# EasyEDA schematic SCH_Avionic1_2026-04-20.json
TITLE: Sheet_1; REV: 1.0; Date: 2026-02-07; Sheet: 1/1; Company: Your Company
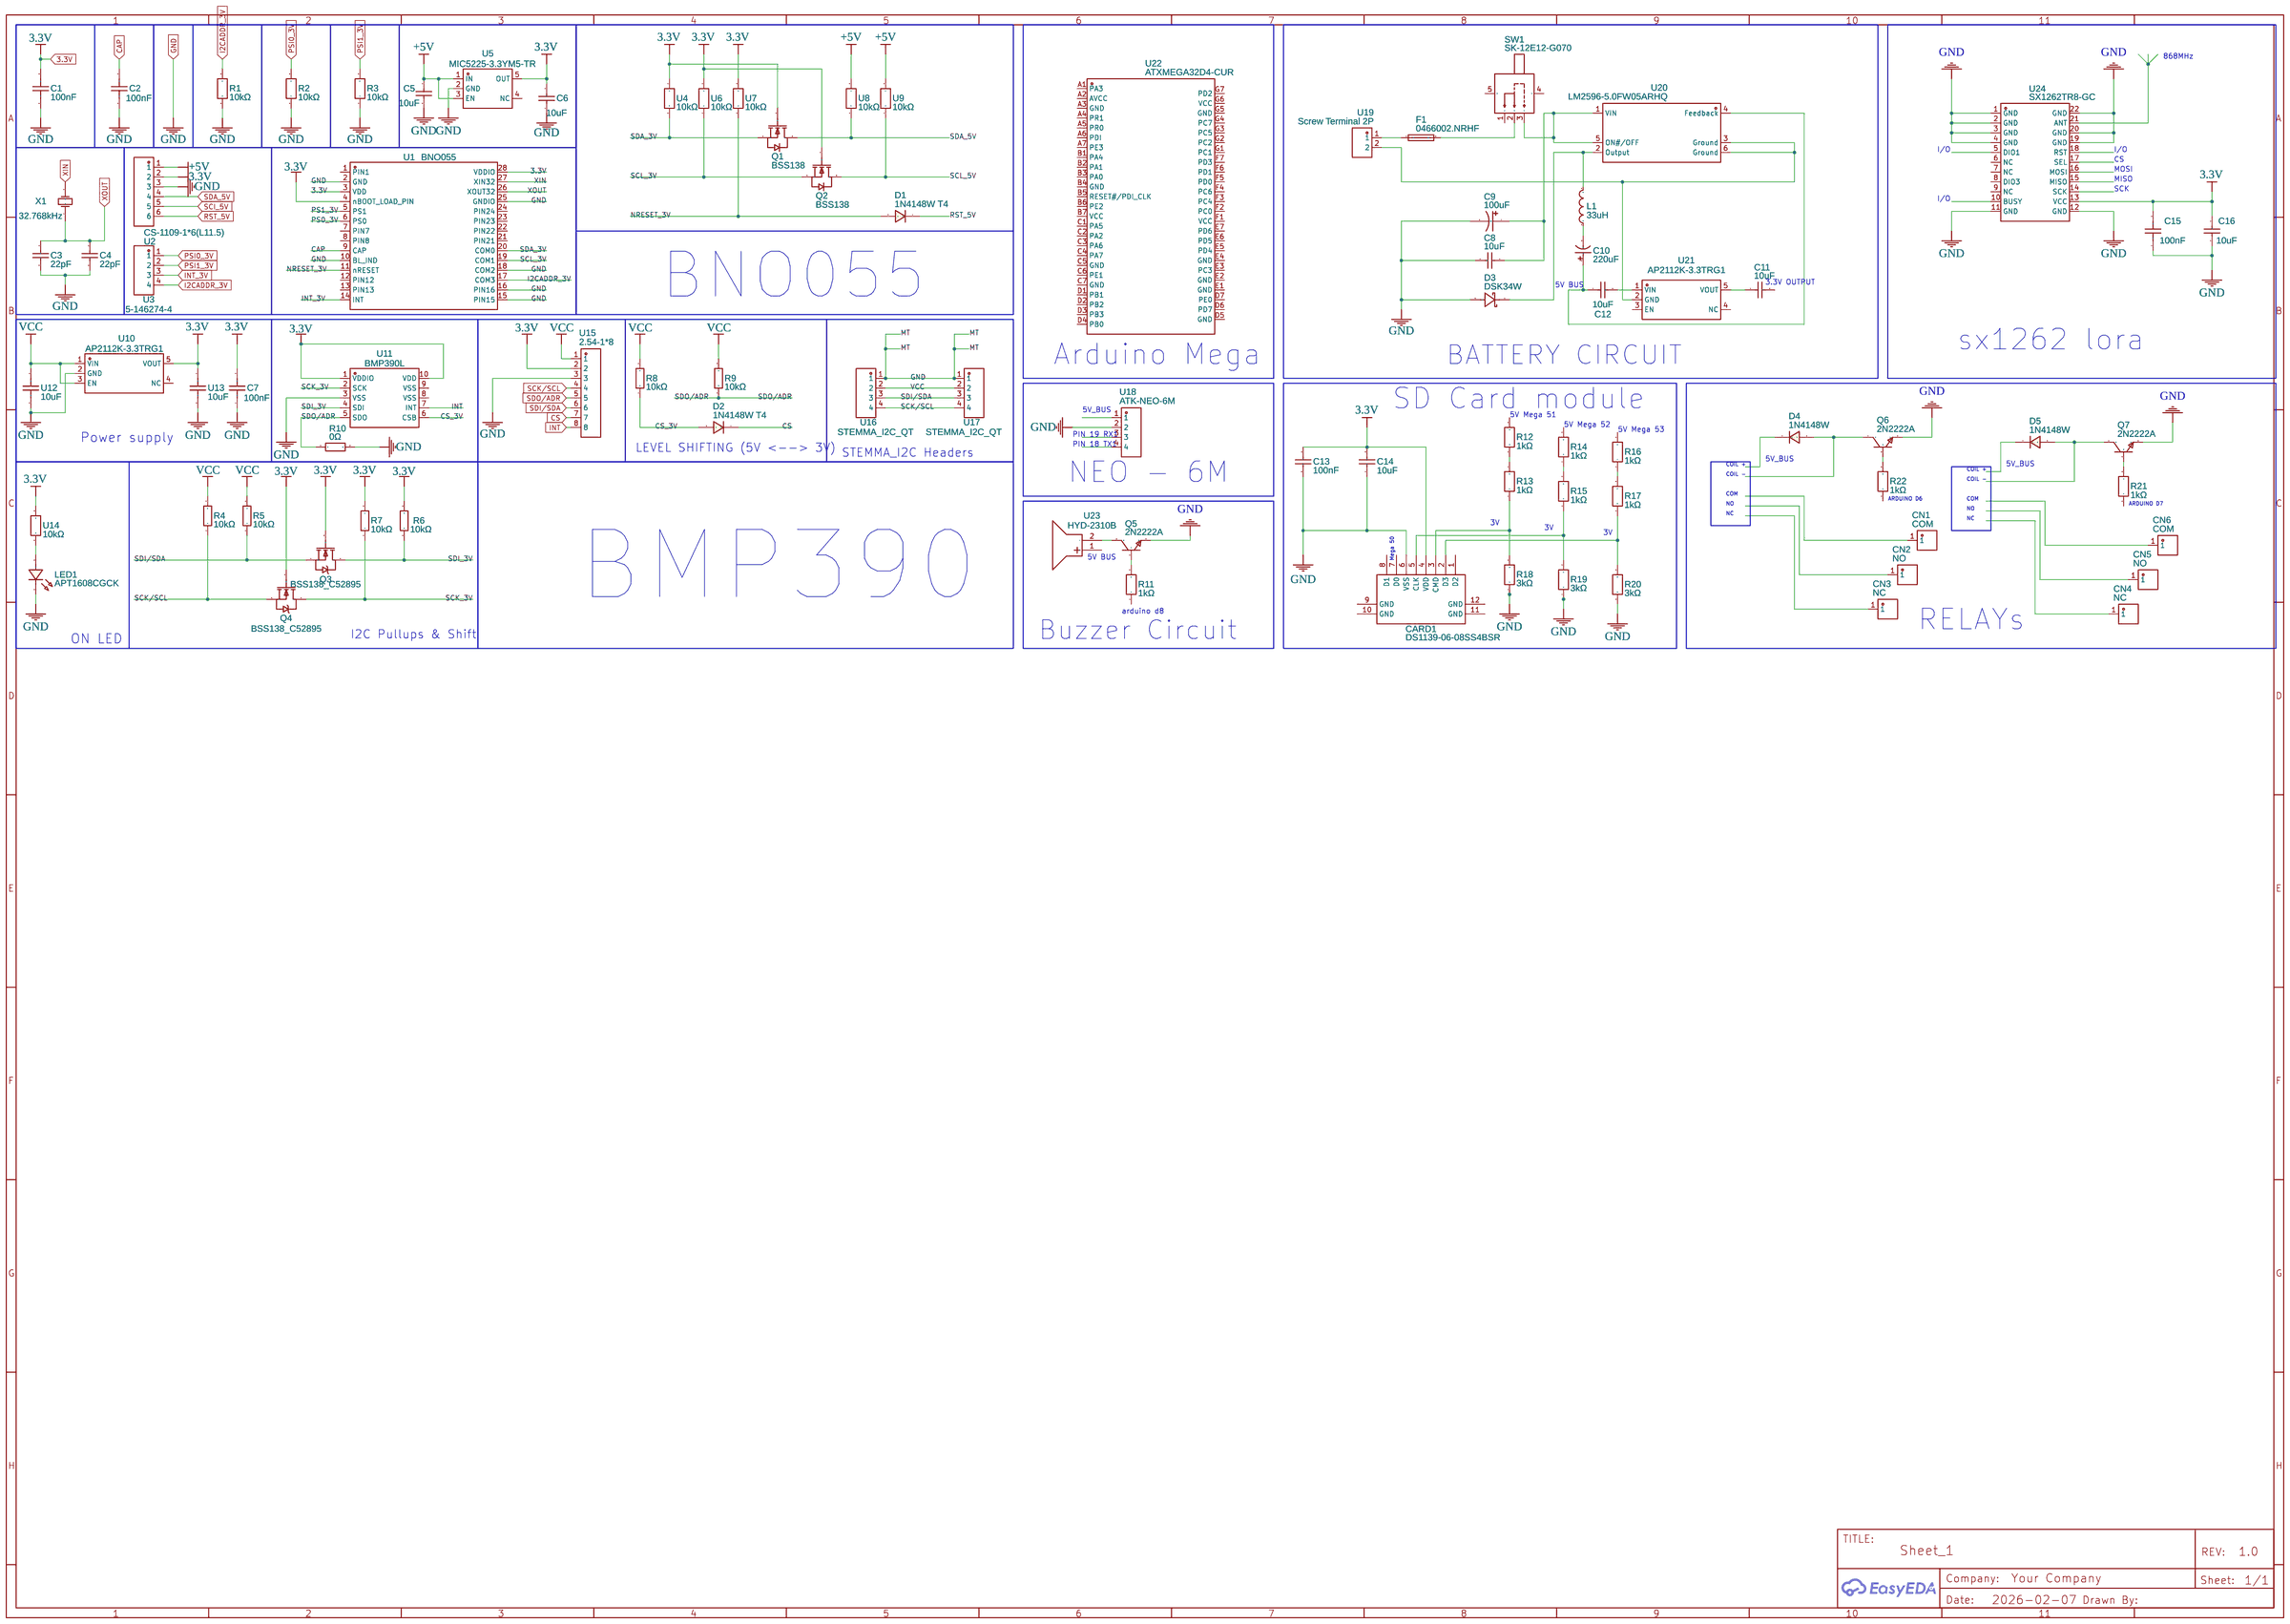
[diagram p0: schematic sheet]

## Parts
C1  100nF  [C0402]
C2  100nF  [C0402]
C3  22pF  [C0603]
C4  22pF  [C0603]
C5  10uF  [C0805]
C6  10uF  [C0805]
C7  100nF  [C0402]
C8  10uF  [C0805]
C9  100uF  [CAP-TH_BD6.3-P2.50-D1.0-FD]
C10  220uF  [CAP-TH_BD6.3-P2.50-D1.0-FD]
C11  10uF  [C0805]
C12  10uF  [C0805]
C13  100nF  [C0603]
C14  10uF  [C0805]
C15  100nF  [C0402]
C16  10uF  [C0805]
CARD1  DS1139-06-08SS4BSR  [TF-SMD_DS1139-06-08SS4BSR]
CN1  COM  [FL_001]
CN2  NO  [FL_001]
CN3  NC  [FL_001]
CN4  NC  [FL_001]
CN5  NO  [FL_001]
CN6  COM  [FL_001]
D1  1N4148W T4  [SOD-123_L2.8-W1.8-LS3.7-RD]
D2  1N4148W T4  [SOD-123_L2.8-W1.8-LS3.7-RD]
D3  DSK34W  [SOD-123_L2.8-W1.8-LS3.7-RD]
D4  1N4148W  [SOD-123_L2.8-W1.8-LS3.7-RD]
D5  1N4148W  [SOD-123_L2.8-W1.8-LS3.7-RD]
F1  0466002.NRHF  [F1206]
L1  33uH  [IND-SMD_L5.0-W5.0_FNR5012S]
LED1  APT1608CGCK  [LED0603-FD_WHITE]
Q1  BSS138  [SOT-23-3_L2.9-W1.3-P1.90-LS2.4-BR]
Q2  BSS138  [SOT-23-3_L2.9-W1.3-P1.90-LS2.4-BR]
Q3  BSS138_C52895  [SOT-23-3_L2.9-W1.6-P1.90-LS2.8-BR]
Q4  BSS138_C52895  [SOT-23-3_L2.9-W1.6-P1.90-LS2.8-BR]
Q5  2N2222A  [TO-92-3_L4.8-W3.7-P2.54-R]
Q6  2N2222A  [TO-92-3_L4.8-W3.7-P2.54-R]
Q7  2N2222A  [TO-92-3_L4.8-W3.7-P2.54-R]
R1  10kΩ  [R0402]
R2  10kΩ  [R0402]
R3  10kΩ  [R0402]
R4  10kΩ  [R0603]
R5  10kΩ  [R0603]
R6  10kΩ  [R0603]
R7  10kΩ  [R0603]
R8  10kΩ  [R0603]
R9  10kΩ  [R0603]
R10  0Ω  [R0603]
R11  1kΩ  [R0402]
R12  1kΩ  [R0402]
R13  1kΩ  [R0402]
R14  1kΩ  [R0402]
R15  1kΩ  [R0402]
R16  1kΩ  [R0402]
R17  1kΩ  [R0402]
R18  3kΩ  [R0402]
R19  3kΩ  [R0402]
R20  3kΩ  [R0402]
R21  1kΩ  [R0402]
R22  1kΩ  [R0402]
SW1  SK-12E12-G070  [SW-TH_SK-12E12-G070]
U1  BNO055  [LGA-28_L5.2-W3.8-P0.50-BL]
U2  CS-1109-1*6(L11.5)  [HDR-TH_6P-P2.54-V-M]
U3  5-146274-4  [HDR-TH_4P-P2.54-V-M]
U4  10kΩ  [R0603]
U5  MIC5225-3.3YM5-TR  [SOT-23-5_L3.0-W1.7-P0.95-LS2.8-BL]
U6  10kΩ  [R0603]
U7  10kΩ  [R0603]
U8  10kΩ  [R0603]
U9  10kΩ  [R0603]
U10  AP2112K-3.3TRG1  [SOT-25-5_L2.9-W1.6-P0.95-LS2.8-BL]
U11  BMP390L  [LGA-10_L2.0-W2.0-P0.50-TL_BMP390L]
U12  10uF  [C0805]
U13  10uF  [C0805]
U14  10kΩ  [R0603]
U15  2.54-1*8  [HDR-TH_8P-P2.54-V-M]
U16  STEMMA_I2C_QT  [HDR-TH_4P-P2.54-V-M]
U17  STEMMA_I2C_QT  [HDR-TH_4P-P2.54-V-M]
U18  ATK-NEO-6M  [TH_ATK-NEO-6M]
U19  Screw Terminal 2P  [CONN-TH_2P-P5.08-WJ500V-5.08-2P]
U20  LM2596-5.0FW05ARHQ  [TO-263-5_L10.1-W8.7-P1.70-LS14.4-BR]
U21  AP2112K-3.3TRG1  [SOT-25-5_L2.9-W1.6-P0.95-LS2.8-BL]
U22  ATXMEGA32D4-CUR  [BGA-49_L5.0-W5.0-R7-C7-P0.65-TL_ATXMEGA16D4-CU]
U23  HYD-2310B  [BUZ-TH_BD23.0-P15.00-D0.8-FD]
U24  SX1262TR8-GC  [WIRELM-SMD_22P-L15.0-W15.0-P1.27_SX1278ZTR47-GC]
X1  32.768kHz  [OSC-TH_BD2.0-P0.70-D0.3]

## Library data of the parts
C1 C2 C15 = CL05B104KO5NNNC: Supplier: LCSC; Manufacturer: SAMSUNG(三星); Supplier Part: C1525; JLCPCB Part Class: Basic Part
C3 C4 = CL10C220JB8NNNC: Supplier: LCSC; Manufacturer: SAMSUNG(三星); Supplier Part: C1653; JLCPCB Part Class: Basic Part
C5 C6 C8 C11 C12 C14 C16 = CL21A106KOQNNNE: Supplier: LCSC; Manufacturer: SAMSUNG(三星); Supplier Part: C1713; JLCPCB Part Class: Extended Part
C7 = CC0402KRX5R6BB104: Contributor: LCSC; Supplier: LCSC; Supplier Part: C129131; Manufacturer: YAGEO(国巨); JLCPCB Part Class: Extended Part
C9 = NXA 25V100 6.3*11: Contributor: LCSC; Supplier: LCSC; Supplier Part: C165558; Manufacturer: SAMYOUNG(韩国三莹); Manufacturer Part: NXA25V100M6.3*11 2.5TP; JLCPCB Part Class: Extended Part
C10 = MHA-16V220-6.3*11: Contributor: LCSC; Supplier: LCSC; Supplier Part: C165514; Manufacturer: SAMYOUNG(韩国三莹); Manufacturer Part: MHA 16V220 6.3*11; JLCPCB Part Class: Extended Part
C13 = CL10B104KA8NNNC: Supplier: LCSC; Manufacturer: SAMSUNG(三星); Supplier Part: C1590; JLCPCB Part Class: Extended Part
CARD1 = DS1139-06-08SS4BSR: Supplier: LCSC; Manufacturer: CONNFLY; Supplier Part: C86574; JLCPCB Part Class: Extended Part
CN1-CN6 = DB2EK-5.08-3P-GN-S: Supplier: LCSC; Supplier Part: C395741; Manufacturer: DORABO(地博电气); JLCPCB Part Class: Extended Part; Contributor: lcsc
D1 D2 = 1N4148W T4: Contributor: 立创EDA官方封装库; Supplier: LCSC; Manufacturer: CJ(江苏长电/长晶); Manufacturer Part: 1N4148W; Supplier Part: C2099; JLCPCB Part Class: Extended Part
D3 = DSK34W: Supplier: LCSC; Supplier Part: C3014041; Manufacturer: FOSAN(富捷/富信); Contributor: lcsc; JLCPCB Part Class: Extended Part
D4 D5 = 1N4148W: Contributor: LCSC; Supplier: LCSC; Manufacturer: HT(金誉); Supplier Part: C179717; JLCPCB Part Class: Extended Part
F1 = 0466002.NRHF: Supplier: LCSC; Manufacturer: Littelfuse(美国力特); Supplier Part: C3105; JLCPCB Part Class: Extended Part
L1 = CKCS5040-33UH/M: Contributor: LCSC; Supplier: LCSC; Supplier Part: C354612; Manufacturer: CENKER(岑科); Manufacturer Part: CKCS5040-33uH/M; JLCPCB Part Class: Extended Part
LED1 = APT1608CGCK: Supplier: LCSC; Supplier Part: C5119770; Manufacturer: Kingbright; JLCPCB Part Class: Extended Part; Contributor: lcsc
Q1 Q2 = BSS138: Supplier: LCSC; Manufacturer: CJ(江苏长电/长晶); Supplier Part: C78284; JLCPCB Part Class: Extended Part
Q3 Q4 = BSS138_C52895: Supplier: LCSC; Manufacturer: onsemi(安森美); Manufacturer Part: BSS138; Supplier Part: C52895; JLCPCB Part Class: Extended Part
Q5-Q7 = 2N2222A: Contributor: LCSC; Supplier: LCSC; Supplier Part: C358533; Manufacturer: BLUE ROCKET(蓝箭); JLCPCB Part Class: Extended Part
R1-R3 = 0402 ±1% 10K: Contributor: lcsc; Supplier: LCSC; Supplier Part: C2889342; Manufacturer: VO(翔胜); JLCPCB Part Class: Extended Part
R4-R9 = 0603WAJ0103T5E: Supplier: LCSC; Manufacturer: UNI-ROYAL(厚声); Supplier Part: C15401; JLCPCB Part Class: Extended Part
R10 = RCT030RJLF: Contributor: LCSC; Supplier: LCSC; Manufacturer: HKR(香港电阻); Manufacturer Part: RCT030RLF; Supplier Part: C177335; JLCPCB Part Class: Extended Part
R11-R17 R21 R22 = RCT021KFLF: Contributor: LCSC; Supplier: LCSC; Supplier Part: C173697; Manufacturer: HKR(香港电阻); JLCPCB Part Class: Extended Part
R18-R20 = RCT023KFLF: Contributor: LCSC; Supplier: LCSC; Supplier Part: C173561; Manufacturer: HKR(香港电阻); JLCPCB Part Class: Extended Part
SW1 = SK-12E12-G070: Supplier: LCSC; Supplier Part: C22448004; Manufacturer: G-Switch(品赞); Contributor: lcsc; JLCPCB Part Class: Extended Part
U1 = BNO055: Contributor: LCSC; Supplier: LCSC; Supplier Part: C93216; Manufacturer: Bosch(博世); JLCPCB Part Class: Extended Part
U2 = CS-1109-1*6(L11.5): Contributor: lcsc; Supplier: LCSC; Supplier Part: C5142852; Manufacturer: CST(永丰盈); JLCPCB Part Class: Extended Part
U3 U16 U17 = 5-146274-4: Contributor: lcsc; Supplier: LCSC; Supplier Part: C3332609; Manufacturer: TE Connectivity(泰科电子); JLCPCB Part Class: Extended Part
U4 U6-U9 U14 = HOLTT0603-1/10W-10K-1%: Contributor: lcsc; Supplier: LCSC; Supplier Part: C2904526; Manufacturer: Milliohm(毫欧); Manufacturer Part: HoLTT0603-1/10W-10K-1%; JLCPCB Part Class: Extended Part
U5 = MIC5225-3.3YM5-TR: Contributor: LCSC; Supplier: LCSC; Supplier Part: C512101; Manufacturer: MICROCHIP(美国微芯); JLCPCB Part Class: Extended Part
U10 U21 = AP2112K-3.3TRG1: Contributor: LCSC; Supplier: LCSC; Manufacturer: DIODES(美台); Supplier Part: C51118; JLCPCB Part Class: Extended Part
U11 = BMP390L: Supplier: LCSC; Supplier Part: C2684802; Manufacturer: Bosch(博世); JLCPCB Part Class: Extended Part; Contributor: lcsc
U12 U13 = CC0805KKX7R6BB106: Contributor: lcsc; Supplier: LCSC; Supplier Part: C1952580; Manufacturer: YAGEO(国巨); JLCPCB Part Class: Extended Part
U15 = 2.54-1*8: Supplier: LCSC; Supplier Part: C5156616; Manufacturer: ZHOURI(洲日); JLCPCB Part Class: Extended Part; Contributor: lcsc
U18 = ATK-NEO-6M: Contributor: lcsc; Supplier: LCSC; Supplier Part: C9900025554; Manufacturer: null
U19 = WJ500V-5.08-2P-13-00A: Supplier: LCSC; Supplier Part: C42377752; Manufacturer: KANGNEX(康奈克斯电气); Manufacturer Part: WJ500V-5.08-02P-13-00A; JLCPCB Part Class: Extended Part; Contributor: lcsc
U20 = LM2596-5.0FW05ARHQ: Supplier: LCSC; Supplier Part: C46641091; Manufacturer: GR(国睿); Contributor: lcsc; JLCPCB Part Class: Extended Part
U22 = ATXMEGA32D4-CUR: Contributor: LCSC; Supplier: LCSC; Supplier Part: C2055146; Manufacturer: null
U23 = HYD-2310B: Supplier: LCSC; Supplier Part: C7544842; Manufacturer: HYDZ(华宇); Contributor: lcsc
U24 = SX1262TR8-GC: Supplier: LCSC; Supplier Part: C42381682; Manufacturer: Silicontra(硅传科技); JLCPCB Part Class: Extended Part; Contributor: lcsc
X1 = X206032768KGB2SC: Supplier: LCSC; Manufacturer: YXC(扬兴晶振); Supplier Part: C2236; JLCPCB Part Class: Extended Part

## Nets
3.3V: C1.2 C6.2 C7.2 C13.1 C14.2 C15.2 C16.1 CARD1.4(VDD) Q1.1(G) Q2.1(G) Q3.1(G) Q4.1(G) R6.2 R7.2 U1.3(VDD) U1.4(nBOOT_LOAD_PIN) U1.28(VDDIO) U2.2 U4.1 U5.5(OUT) U6.2 U7.2 U10.5(VOUT) U11.1(VDDIO) U11.10(VDD) U13.1 U14.2 U15.2 U24.13(VCC)
+5V: C5.1 U2.1 U5.1(IN) U5.3(EN) U8.2 U9.2
GND: C1.1 C2.1 C3.1 C4.1 C5.2 C6.1 C7.1 C8.1 C9.2 C13.2 C14.1 C15.1 C16.2 CARD1.6(VSS) D3.2(A) LED1.2(K) Q5.3(E) Q6.3(E) Q7.3(E) R1.1 R2.1 R3.1 R10.2 R18.1 R19.1 R20.1 U1.2(GND) U1.10(BL_IND) U1.15(PIN15) U1.16(PIN16) U1.18(COM2) U1.25(GNDIO) U2.3 U5.2(GND) U10.2(GND) U11.3(VSS) U12.2 U13.2 U15.3 U16.1 U17.1 U18.2 U24.1(GND) U24.2(GND) U24.3(GND) U24.4(GND) U24.11(GND) U24.12(GND) U24.19(GND) U24.20(GND) U24.22(GND)
VCC: R4.2 R5.2 R8.2 R9.2 U10.1(VIN) U10.3(EN) U12.1 U15.1 U16.2 U17.2
CAP: C2.2 U1.9(CAP)
CS: D2.1(K) U15.7
CS_3V: D2.2(A) R8.1 U11.6(CSB)
I2CADDR_3V: R1.2 U1.17(COM3) U3.4
INT: U11.7(INT) U15.8
INT_3V: U1.14(INT) U3.3
NRESET_3V: D1.2(A) U1.11(nRESET) U7.1
PS0_3V: U1.6(PS0)
PS1_3V: U1.5(PS1)
PSI0_3V: R2.2 U3.1
PSI1_3V: R3.2 U3.2
RST_5V: D1.1(K) U2.6
SCI_5V: U2.5
SCK/SCL: Q4.2(S) R4.1 U15.4 U16.4 U17.4
SCK_3V: Q4.3(D) R7.1 U11.2(SCK)
SCL_3V: Q2.2(S) U1.19(COM1) U6.1
SCL_5V: Q2.3(D) U9.1
SDA_3V: Q1.2(S) U1.20(COM0) U4.2
SDA_5V: Q1.3(D) U2.4 U8.1
SDI/SDA: Q3.2(S) R5.1 U15.6 U16.3 U17.3
SDI_3V: Q3.3(D) R6.1 U11.4(SDI)
SDO/ADR: R9.1 R10.1 U11.5(SDO) U15.5
XIN: U1.27(XIN32) X1.2(OSC2)
XOUT: C3.2 C4.2 U1.26(XOUT32) X1.1(OSC1)
Net-(C8-2): C8.2 C9.1 SW1.3 U20.1(VIN) U20.5(ON#/OFF)
Net-(C10-1): C10.1 C12.1 U20.4(Feedback)
Net-(C10-2): C10.2 L1.1
Net-(C11-1): C11.1 U21.5(VOUT)
Net-(C12-2): C12.2 U21.1(VIN)
Net-(CARD1-2): CARD1.2(D3) R17.1 R20.2
Net-(CARD1-3): CARD1.3(CMD) R13.1 R18.2
Net-(CARD1-5): CARD1.5(CLK) R15.1 R19.2
Net-(D3-1): D3.1(K) L1.2 U20.2(Output)
Net-(D4-2): D4.2(A) Q6.1(C)
Net-(D5-2): D5.2(A) Q7.1(C)
Net-(F1-1): F1.1 U19.1
Net-(F1-2): F1.2 SW1.2
Net-(LED1-1): LED1.1(A) U14.1
Net-(Q5-1): Q5.1(C) U23.2(-)
Net-(Q5-2): Q5.2(B) R11.2
Net-(Q6-2): Q6.2(B) R22.2
Net-(Q7-2): Q7.2(B) R21.2
Net-(R12-1): R12.1 R13.2
Net-(R14-1): R14.1 R15.2
Net-(R16-1): R16.1 R17.2
Net-(U19-2): U19.2 U20.3(Ground) U20.6(Ground) U21.2(GND)

Not connected (* = marked no-connect by the designer): C11 2; CARD1 1(D2) 7(D0) 8(D1) 9(GND) 10(GND) 11(GND) 12(GND); CN1 1; CN2 1; CN3 1; CN4 1; CN5 1; CN6 1; D4 1(K); D5 1(K); R11 1; R12 2; R14 2; R16 2; R21 1; R22 1; SW1 1 4 5; U1 1(PIN1) 7(PIN7) 8(PIN8) 12(PIN12) 13(PIN13) 21(PIN21) 22(PIN22) 23(PIN23) 24(PIN24); U5 4(NC); U10 4(NC); U11 8(VSS) 9(VSS); U18 1 3 4; U21 3(EN) 4(NC); U22 A1(PA3) A2(AVCC) A3(GND) A4(PR1) A5(PR0) A6(PDI) A7(PE3) B1(PA4) B2(PA1) B3(PA0) B4(GND) B5(RESET#/PDI_CLK) B6(PE2) B7(VCC) C1(PA5) C2(PA2) C3(PA6) C4(PA7) C5(GND) C6(PE1) C7(GND) D1(PB1) D2(PB2) D3(PB3) D4(PB0) D5(GND) D6(PD7) D7(PE0) E1(GND) E2(GND) E3(PC3) E4(GND) E5(PD4) E6(PD5) E7(PD6) F1(VCC) F2(PC0) F3(PC4) F4(PC6) F5(PD0) F6(PD1) F7(PD3) G1(PC1) G2(PC2) G3(PC5) G4(PC7) G5(GND) G6(VCC) G7(PD2); U23 1(+); U24 5(DIO1) 6(NC) 7(NC) 8(DIO3) 9(NC) 10(BUSY) 14(SCK) 15(MISO) 16(MOSI) 17(SEL) 18(RST) 21(ANT)

## Notes on the sheet
- 868MHz
- I/O
- I/O
- CS
- MOSI
- MISO
- SCK
- I/O
- BNO055
- 5V BUS
- 3.3V OUTPUT
- sx1262 lora
- Arduino Mega
- BATTERY CIRCUIT
- SD Card module
- 5V_BUS
- 5V Mega 51
- 5V Mega 52
- Power supply
- PIN 19 RX1
- 5V Mega 53
- LEVEL SHIFTING (5V <--> 3V)
- STEMMA_I2C Headers
- PIN 18 TX1
- NEO - 6M
- 5V_BUS
- COIL +
- COIL -
- COIL +
- 5V_BUS
- COIL -
- COM
- NO
- ARDUINO D6
- COM
- NO
- ARDUINO D7
- NC
- NC
- BMP390
- 3V
- 3V
- 3V
- 5V BUS
- Mega 50
- arduino d8
- RELAYs
- Buzzer Circuit
- ON LED
- I2C Pullups & Shift
